# EAGLE schematic breakout (EAGLE 9.6.2)
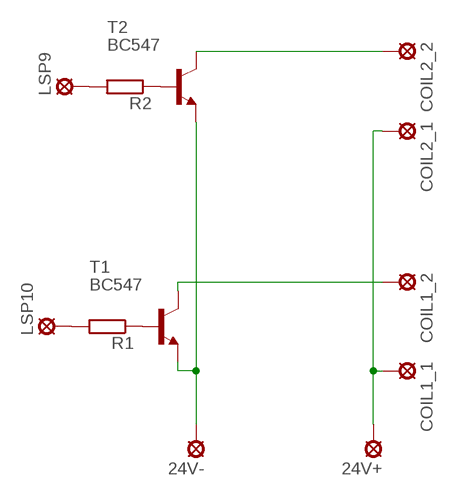
[diagram p0: schematic, sheet 1]

## Parts
24V+  LSP10  [LSP10]
24V-  LSP10  [LSP10]
COIL1_1  LSP10  [LSP10]
COIL1_2  LSP10  [LSP10]
COIL2_1  LSP10  [LSP10]
COIL2_2  LSP10  [LSP10]
LSP9  LSP10  [LSP10]
LSP10  LSP10  [LSP10]
R1  R-EU_V235/17  [V235/17]
R2  R-EU_V235/17  [V235/17]
T1  BC547  [TO92]
T2  BC547  [TO92]

## Nets
N$1: LSP10.MP R1.2
N$2: LSP9.MP R2.2
N$3: 24V+.MP COIL1_1.MP COIL2_1.MP
N$4: 24V-.MP T1.1(E) T2.1(E)
N$5: COIL1_2.MP T1.3(C)
N$6: COIL2_2.MP T2.3(C)
N$7: R1.1 T1.2(B)
N$8: R2.1 T2.2(B)

## Library data of the parts
24V+ 24V- COIL1_1 COIL1_2 COIL2_1 COIL2_2 LSP9 LSP10 = solpad:LSP10: SOLDER PAD drill 1.0 mm, distributor Buerklin, 12H555
R1 R2 = rcl:R-EU_: RESISTOR, European symbol; SPICEPREFIX: R
T1 T2 = transistor:BC547: NPN TRANSISTOR